# Altium project EDU_High-Speed-Design.PrjPcb (part 5 of 5)
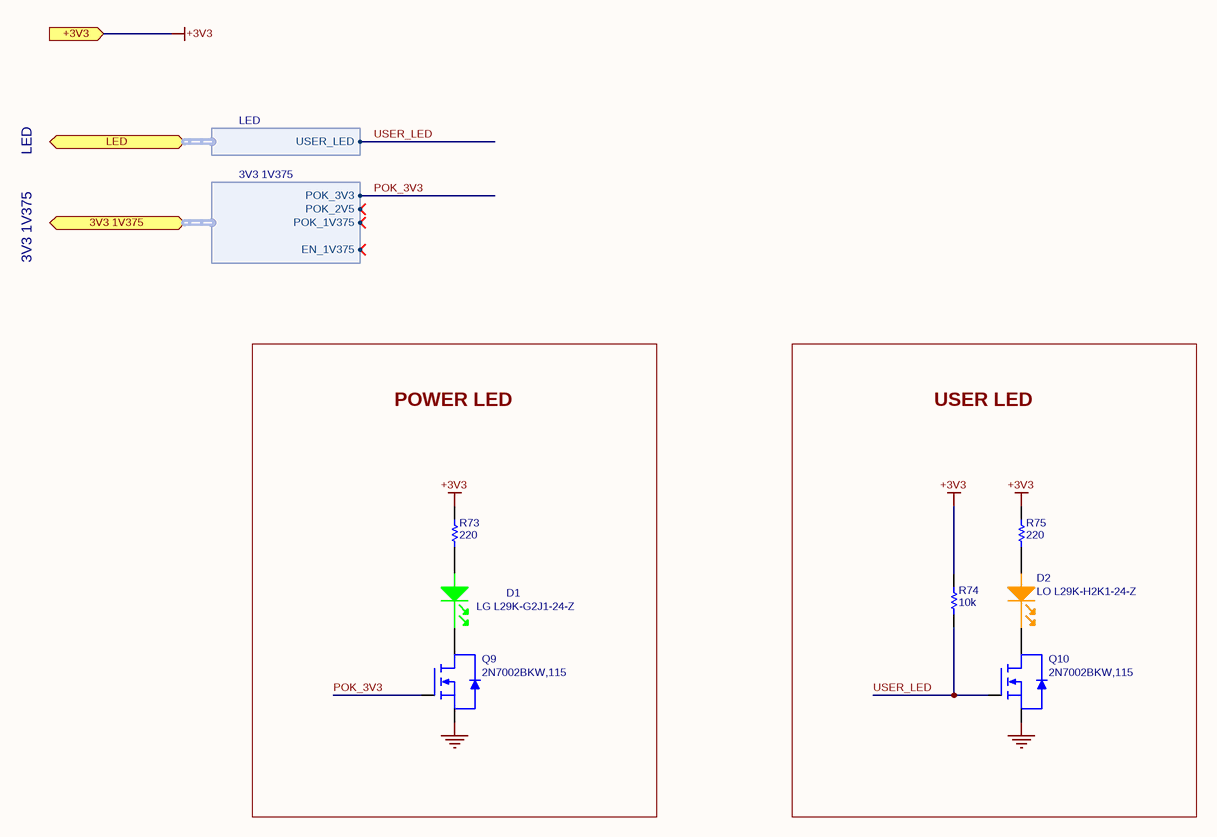
[diagram p32: EDU_High-Speed-Design_LED.SchDoc]

## Nets that join several sheets
+1V1: EDU_High-Speed-Design_CPU_HDMI (C220.1 R118.2), EDU_High-Speed-Design_CPU_PCIe (C228.1 FB8.2 R123.2), EDU_High-Speed-Design_CPU_SATA (R130.2)
+1V2_ETH: EDU_High-Speed-Design_CPU_Power (R80.1), EDU_High-Speed-Design_Ethernet (10 pins)
+1V5_DDR: EDU_High-Speed-Design_CPU_Control (R150.2), EDU_High-Speed-Design_CPU_DDR3 (30 pins), EDU_High-Speed-Design_DDR3 (113 pins), EDU_High-Speed-Design_Power_2V5_1V5 (C13.1 C15.1 L2.2 U1.30)
+1V375: EDU_High-Speed-Design_CPU_Power (30 pins), EDU_High-Speed-Design_Ethernet (FB1.2), EDU_High-Speed-Design_Power_3V3_1V375 (5 pins)
+2V5: EDU_High-Speed-Design_CPU_Power (C174.1 R76.1 R77.2 R78.2), EDU_High-Speed-Design_CPU_LVDS (R127.2), EDU_High-Speed-Design_CPU_HDMI (C217.1 R114.2), EDU_High-Speed-Design_CPU_PCIe (C226.1 R120.2), EDU_High-Speed-Design_CPU_SATA (C237.1 R129.2), EDU_High-Speed-Design_Ethernet (FB3.1), EDU_High-Speed-Design_Power_2V5_1V5 (5 pins)
+3V0: EDU_High-Speed-Design_CPU_Power (6 pins), EDU_High-Speed-Design_CPU_Control (9 pins), EDU_High-Speed-Design_Power_3V3_1V375 (R31.2), EDU_High-Speed-Design_Power_3V0 (6 pins), EDU_High-Speed-Design_Power_2V5_1V5 (R3.2 R6.2)
+3V3: EDU_High-Speed-Design_CPU_Power (21 pins), EDU_High-Speed-Design_CPU_Control (10 pins), EDU_High-Speed-Design_CPU_Audio (R133.2 R134.2), EDU_High-Speed-Design_CPU_USB (R108.2), EDU_High-Speed-Design_CPU_LVDS (R124.1 R125.1 R126.2), EDU_High-Speed-Design_CPU_HDMI (R110.1 R115.1 R116.1 R117.1), EDU_High-Speed-Design_CPU_SD-Card (R92.2 R93.2 R94.2), EDU_High-Speed-Design_CPU_MMC-Card (R97.2 R98.2 R99.2), EDU_High-Speed-Design_CPU_SPI_I2C (R104.1 R105.1), EDU_High-Speed-Design_Connectors (C36.1 J2.50), EDU_High-Speed-Design_Ethernet (C93.1 FB2.1 U9.1), EDU_High-Speed-Design_Flash (C121.1 R71.2 R72.2 U10.8), EDU_High-Speed-Design_Power_3V3_1V375 (7 pins), EDU_High-Speed-Design_LED (R73.1 R74.2 R75.1)
+5V_LDO1: EDU_High-Speed-Design_Power_3V3_1V375 (6 pins), EDU_High-Speed-Design_Power_2V5_1V5 (R1.2 R2.2)
+5V_USB: EDU_High-Speed-Design_CPU_USB (C212.2 C213.2 U11.D10 U11.E9), EDU_High-Speed-Design_Connectors (C41.1 J1.18)
+DDR_VREF: EDU_High-Speed-Design_CPU_DDR3 (6 pins), EDU_High-Speed-Design_DDR3 (16 pins)
+VIN: EDU_High-Speed-Design_Connectors (9 pins), EDU_High-Speed-Design_Power_3V3_1V375 (7 pins), EDU_High-Speed-Design_Power_3V0 (C16.1 U2.2 U2.3), EDU_High-Speed-Design_Power_2V5_1V5 (7 pins)
GND: EDU_High-Speed-Design_CPU_Power (182 pins), EDU_High-Speed-Design_CPU_Control (18 pins), EDU_High-Speed-Design_CPU_USB (C212.1 C213.1 C214.2 C215.2), EDU_High-Speed-Design_CPU_LVDS (C230.2 C231.2), EDU_High-Speed-Design_CPU_HDMI (7 pins), EDU_High-Speed-Design_CPU_PCIe (8 pins), EDU_High-Speed-Design_CPU_DDR3 (21 pins), EDU_High-Speed-Design_CPU_SATA (C234.2 C237.2 C238.2 R128.1), EDU_High-Speed-Design_Connectors (16 pins), EDU_High-Speed-Design_Ethernet (39 pins), EDU_High-Speed-Design_Flash (C121.2 U10.4 U10.9), EDU_High-Speed-Design_DDR3 (137 pins), EDU_High-Speed-Design_Power_3V3_1V375 (31 pins), EDU_High-Speed-Design_Power_3V0 (8 pins), EDU_High-Speed-Design_Power_2V5_1V5 (29 pins), EDU_High-Speed-Design_LED (Q9.2 Q10.2)
AUD3_CLK: EDU_High-Speed-Design_CPU_Audio (R132.1), EDU_High-Speed-Design_Connectors (J2.20)
AUD3_RXD: EDU_High-Speed-Design_CPU_Audio (U11.N3), EDU_High-Speed-Design_Connectors (J2.22)
AUD3_TXC: EDU_High-Speed-Design_CPU_Audio (R131.1), EDU_High-Speed-Design_Connectors (J2.16)
AUD3_TXD: EDU_High-Speed-Design_CPU_Audio (U11.P2), EDU_High-Speed-Design_Connectors (J2.18)
AUD3_TXFS: EDU_High-Speed-Design_CPU_Audio (U11.N4), EDU_High-Speed-Design_Connectors (J2.24)
BOOT_MODE: EDU_High-Speed-Design_CPU_Control (Q11.1 R135.1), EDU_High-Speed-Design_Connectors (J1.50)
CLK1_N: EDU_High-Speed-Design_CPU_PCIe (C222.2 R121.2), EDU_High-Speed-Design_Connectors (J2.46)
CLK1_P: EDU_High-Speed-Design_CPU_PCIe (C225.2 R122.2), EDU_High-Speed-Design_Connectors (J2.48)
CPU_GPIO1: EDU_High-Speed-Design_CPU_SPI_I2C (R103.2 R104.2 U11.D16), EDU_High-Speed-Design_Connectors (J1.37)
CSPI2_CLK: EDU_High-Speed-Design_CPU_SPI_I2C (R101.1), EDU_High-Speed-Design_Connectors (J1.17)
CSPI2_CS0: EDU_High-Speed-Design_CPU_SPI_I2C (U11.V25), EDU_High-Speed-Design_Connectors (J1.19)
CSPI2_MISO: EDU_High-Speed-Design_CPU_SPI_I2C (U11.U24), EDU_High-Speed-Design_Connectors (J1.21)
CSPI2_MOSI: EDU_High-Speed-Design_CPU_SPI_I2C (U11.T21), EDU_High-Speed-Design_Connectors (J1.23)
CSPI3_CLK: EDU_High-Speed-Design_CPU_SPI_I2C (R100.1), EDU_High-Speed-Design_Flash (U10.6)
CSPI3_CS2: EDU_High-Speed-Design_CPU_SPI_I2C (U11.R25), EDU_High-Speed-Design_Flash (U10.1)
CSPI3_MISO: EDU_High-Speed-Design_CPU_SPI_I2C (U11.P23), EDU_High-Speed-Design_Flash (U10.2)
CSPI3_MOSI: EDU_High-Speed-Design_CPU_SPI_I2C (U11.P22), EDU_High-Speed-Design_Flash (U10.5)
DRAM_A0: EDU_High-Speed-Design_CPU_DDR3 (U11.AC14), EDU_High-Speed-Design_DDR3 (U4.N3 U5.N3 U6.N3 U7.N3)
DRAM_A1: EDU_High-Speed-Design_CPU_DDR3 (U11.AB14), EDU_High-Speed-Design_DDR3 (U4.P7 U5.P7 U6.P7 U7.P7)
DRAM_A2: EDU_High-Speed-Design_CPU_DDR3 (U11.AA14), EDU_High-Speed-Design_DDR3 (U4.P3 U5.P3 U6.P3 U7.P3)
DRAM_A3: EDU_High-Speed-Design_CPU_DDR3 (U11.Y14), EDU_High-Speed-Design_DDR3 (U4.N2 U5.N2 U6.N2 U7.N2)
DRAM_A4: EDU_High-Speed-Design_CPU_DDR3 (U11.W14), EDU_High-Speed-Design_DDR3 (U4.P8 U5.P8 U6.P8 U7.P8)
DRAM_A5: EDU_High-Speed-Design_CPU_DDR3 (U11.AE13), EDU_High-Speed-Design_DDR3 (U4.P2 U5.P2 U6.P2 U7.P2)
DRAM_A6: EDU_High-Speed-Design_CPU_DDR3 (U11.AC13), EDU_High-Speed-Design_DDR3 (U4.R8 U5.R8 U6.R8 U7.R8)
DRAM_A7: EDU_High-Speed-Design_CPU_DDR3 (U11.Y13), EDU_High-Speed-Design_DDR3 (U4.R2 U5.R2 U6.R2 U7.R2)
DRAM_A8: EDU_High-Speed-Design_CPU_DDR3 (U11.AB13), EDU_High-Speed-Design_DDR3 (U4.T8 U5.T8 U6.T8 U7.T8)
DRAM_A9: EDU_High-Speed-Design_CPU_DDR3 (U11.AE12), EDU_High-Speed-Design_DDR3 (U4.R3 U5.R3 U6.R3 U7.R3)
DRAM_A10: EDU_High-Speed-Design_CPU_DDR3 (U11.AA15), EDU_High-Speed-Design_DDR3 (U4.L7 U5.L7 U6.L7 U7.L7)
DRAM_A11: EDU_High-Speed-Design_CPU_DDR3 (U11.AC12), EDU_High-Speed-Design_DDR3 (U4.R7 U5.R7 U6.R7 U7.R7)
DRAM_A12: EDU_High-Speed-Design_CPU_DDR3 (U11.AD12), EDU_High-Speed-Design_DDR3 (U4.N7 U5.N7 U6.N7 U7.N7)
DRAM_A13: EDU_High-Speed-Design_CPU_DDR3 (U11.AC17), EDU_High-Speed-Design_DDR3 (U4.T3 U5.T3 U6.T3 U7.T3)
DRAM_A14: EDU_High-Speed-Design_CPU_DDR3 (U11.AA12), EDU_High-Speed-Design_DDR3 (U4.T7 U5.T7 U6.T7 U7.T7)
DRAM_A15: EDU_High-Speed-Design_CPU_DDR3 (U11.Y12), EDU_High-Speed-Design_DDR3 (U4.M7 U5.M7 U6.M7 U7.M7)
DRAM_CAS_B: EDU_High-Speed-Design_CPU_DDR3 (U11.AE16), EDU_High-Speed-Design_DDR3 (U4.K3 U5.K3 U6.K3 U7.K3)
DRAM_CLK0_N: EDU_High-Speed-Design_CPU_DDR3 (R86.2 U11.AE15), EDU_High-Speed-Design_DDR3 (U5.K7 U7.K7)
DRAM_CLK0_P: EDU_High-Speed-Design_CPU_DDR3 (R86.1 U11.AD15), EDU_High-Speed-Design_DDR3 (U5.J7 U7.J7)
DRAM_CLK1_N: EDU_High-Speed-Design_CPU_DDR3 (R87.2 U11.AE14), EDU_High-Speed-Design_DDR3 (U4.K7 U6.K7)
DRAM_CLK1_P: EDU_High-Speed-Design_CPU_DDR3 (R87.1 U11.AD14), EDU_High-Speed-Design_DDR3 (U4.J7 U6.J7)
DRAM_CS0_B: EDU_High-Speed-Design_CPU_DDR3 (U11.Y16), EDU_High-Speed-Design_DDR3 (U4.L2 U5.L2 U6.L2 U7.L2)
DRAM_D0: EDU_High-Speed-Design_CPU_DDR3 (U11.AD2), EDU_High-Speed-Design_DDR3 (U4.D7)
DRAM_D1: EDU_High-Speed-Design_CPU_DDR3 (U11.AE2), EDU_High-Speed-Design_DDR3 (U4.B8)
DRAM_D2: EDU_High-Speed-Design_CPU_DDR3 (U11.AC4), EDU_High-Speed-Design_DDR3 (U4.C8)
DRAM_D3: EDU_High-Speed-Design_CPU_DDR3 (U11.AA5), EDU_High-Speed-Design_DDR3 (U4.A3)
DRAM_D4: EDU_High-Speed-Design_CPU_DDR3 (U11.AC1), EDU_High-Speed-Design_DDR3 (U4.C2)
DRAM_D5: EDU_High-Speed-Design_CPU_DDR3 (U11.AD1), EDU_High-Speed-Design_DDR3 (U4.C3)
DRAM_D6: EDU_High-Speed-Design_CPU_DDR3 (U11.AB4), EDU_High-Speed-Design_DDR3 (U4.A2)
DRAM_D7: EDU_High-Speed-Design_CPU_DDR3 (U11.AE4), EDU_High-Speed-Design_DDR3 (U4.A7)
DRAM_D8: EDU_High-Speed-Design_CPU_DDR3 (U11.AD5), EDU_High-Speed-Design_DDR3 (U4.E3)
DRAM_D9: EDU_High-Speed-Design_CPU_DDR3 (U11.AE5), EDU_High-Speed-Design_DDR3 (U4.F7)
DRAM_D10: EDU_High-Speed-Design_CPU_DDR3 (U11.AA6), EDU_High-Speed-Design_DDR3 (U4.G2)
DRAM_D11: EDU_High-Speed-Design_CPU_DDR3 (U11.AE7), EDU_High-Speed-Design_DDR3 (U4.H7)
DRAM_D12: EDU_High-Speed-Design_CPU_DDR3 (U11.AB5), EDU_High-Speed-Design_DDR3 (U4.H3)
DRAM_D13: EDU_High-Speed-Design_CPU_DDR3 (U11.AC5), EDU_High-Speed-Design_DDR3 (U4.F2)
DRAM_D14: EDU_High-Speed-Design_CPU_DDR3 (U11.AB6), EDU_High-Speed-Design_DDR3 (U4.F8)
DRAM_D15: EDU_High-Speed-Design_CPU_DDR3 (U11.AC7), EDU_High-Speed-Design_DDR3 (U4.H8)
DRAM_D16: EDU_High-Speed-Design_CPU_DDR3 (U11.AB7), EDU_High-Speed-Design_DDR3 (U6.E3)
DRAM_D17: EDU_High-Speed-Design_CPU_DDR3 (U11.AA8), EDU_High-Speed-Design_DDR3 (U6.F8)
DRAM_D18: EDU_High-Speed-Design_CPU_DDR3 (U11.AB9), EDU_High-Speed-Design_DDR3 (U6.H7)
DRAM_D19: EDU_High-Speed-Design_CPU_DDR3 (U11.Y9), EDU_High-Speed-Design_DDR3 (U6.H3)
DRAM_D20: EDU_High-Speed-Design_CPU_DDR3 (U11.Y7), EDU_High-Speed-Design_DDR3 (U6.H8)
DRAM_D21: EDU_High-Speed-Design_CPU_DDR3 (U11.Y8), EDU_High-Speed-Design_DDR3 (U6.G2)
DRAM_D22: EDU_High-Speed-Design_CPU_DDR3 (U11.AC8), EDU_High-Speed-Design_DDR3 (U6.F7)
DRAM_D23: EDU_High-Speed-Design_CPU_DDR3 (U11.AA9), EDU_High-Speed-Design_DDR3 (U6.F2)
DRAM_D24: EDU_High-Speed-Design_CPU_DDR3 (U11.AE9), EDU_High-Speed-Design_DDR3 (U6.D7)
DRAM_D25: EDU_High-Speed-Design_CPU_DDR3 (U11.Y10), EDU_High-Speed-Design_DDR3 (U6.A7)
DRAM_D26: EDU_High-Speed-Design_CPU_DDR3 (U11.AE11), EDU_High-Speed-Design_DDR3 (U6.C3)
DRAM_D27: EDU_High-Speed-Design_CPU_DDR3 (U11.AB11), EDU_High-Speed-Design_DDR3 (U6.C2)
DRAM_D28: EDU_High-Speed-Design_CPU_DDR3 (U11.AC9), EDU_High-Speed-Design_DDR3 (U6.C8)
DRAM_D29: EDU_High-Speed-Design_CPU_DDR3 (U11.AD9), EDU_High-Speed-Design_DDR3 (U6.B8)
DRAM_D30: EDU_High-Speed-Design_CPU_DDR3 (U11.AD11), EDU_High-Speed-Design_DDR3 (U6.A2)
DRAM_D31: EDU_High-Speed-Design_CPU_DDR3 (U11.AC11), EDU_High-Speed-Design_DDR3 (U6.A3)
DRAM_D32: EDU_High-Speed-Design_CPU_DDR3 (U11.AA17), EDU_High-Speed-Design_DDR3 (U7.E3)
DRAM_D33: EDU_High-Speed-Design_CPU_DDR3 (U11.AA18), EDU_High-Speed-Design_DDR3 (U7.G2)
DRAM_D34: EDU_High-Speed-Design_CPU_DDR3 (U11.AC18), EDU_High-Speed-Design_DDR3 (U7.F8)
DRAM_D35: EDU_High-Speed-Design_CPU_DDR3 (U11.AE19), EDU_High-Speed-Design_DDR3 (U7.H7)
DRAM_D36: EDU_High-Speed-Design_CPU_DDR3 (U11.Y17), EDU_High-Speed-Design_DDR3 (U7.H3)
DRAM_D37: EDU_High-Speed-Design_CPU_DDR3 (U11.Y18), EDU_High-Speed-Design_DDR3 (U7.F2)
DRAM_D38: EDU_High-Speed-Design_CPU_DDR3 (U11.AB19), EDU_High-Speed-Design_DDR3 (U7.H8)
DRAM_D39: EDU_High-Speed-Design_CPU_DDR3 (U11.AC19), EDU_High-Speed-Design_DDR3 (U7.F7)
DRAM_D40: EDU_High-Speed-Design_CPU_DDR3 (U11.Y19), EDU_High-Speed-Design_DDR3 (U7.D7)
DRAM_D41: EDU_High-Speed-Design_CPU_DDR3 (U11.AB20), EDU_High-Speed-Design_DDR3 (U7.B8)
DRAM_D42: EDU_High-Speed-Design_CPU_DDR3 (U11.AB21), EDU_High-Speed-Design_DDR3 (U7.C2)
DRAM_D43: EDU_High-Speed-Design_CPU_DDR3 (U11.AD21), EDU_High-Speed-Design_DDR3 (U7.A7)
DRAM_D44: EDU_High-Speed-Design_CPU_DDR3 (U11.Y20), EDU_High-Speed-Design_DDR3 (U7.A2)
DRAM_D45: EDU_High-Speed-Design_CPU_DDR3 (U11.AA20), EDU_High-Speed-Design_DDR3 (U7.C8)
DRAM_D46: EDU_High-Speed-Design_CPU_DDR3 (U11.AE21), EDU_High-Speed-Design_DDR3 (U7.A3)
DRAM_D47: EDU_High-Speed-Design_CPU_DDR3 (U11.AC21), EDU_High-Speed-Design_DDR3 (U7.C3)
DRAM_D48: EDU_High-Speed-Design_CPU_DDR3 (U11.AC22), EDU_High-Speed-Design_DDR3 (U5.D7)
DRAM_D49: EDU_High-Speed-Design_CPU_DDR3 (U11.AE22), EDU_High-Speed-Design_DDR3 (U5.C2)
DRAM_D50: EDU_High-Speed-Design_CPU_DDR3 (U11.AE24), EDU_High-Speed-Design_DDR3 (U5.C3)
DRAM_D51: EDU_High-Speed-Design_CPU_DDR3 (U11.AC24), EDU_High-Speed-Design_DDR3 (U5.B8)
DRAM_D52: EDU_High-Speed-Design_CPU_DDR3 (U11.AB22), EDU_High-Speed-Design_DDR3 (U5.A7)
DRAM_D53: EDU_High-Speed-Design_CPU_DDR3 (U11.AC23), EDU_High-Speed-Design_DDR3 (U5.C8)
DRAM_D54: EDU_High-Speed-Design_CPU_DDR3 (U11.AD25), EDU_High-Speed-Design_DDR3 (U5.A3)
DRAM_D55: EDU_High-Speed-Design_CPU_DDR3 (U11.AC25), EDU_High-Speed-Design_DDR3 (U5.A2)
DRAM_D56: EDU_High-Speed-Design_CPU_DDR3 (U11.AB25), EDU_High-Speed-Design_DDR3 (U5.E3)
DRAM_D57: EDU_High-Speed-Design_CPU_DDR3 (U11.AA21), EDU_High-Speed-Design_DDR3 (U5.G2)
DRAM_D58: EDU_High-Speed-Design_CPU_DDR3 (U11.Y25), EDU_High-Speed-Design_DDR3 (U5.H7)
DRAM_D59: EDU_High-Speed-Design_CPU_DDR3 (U11.Y22), EDU_High-Speed-Design_DDR3 (U5.F7)
DRAM_D60: EDU_High-Speed-Design_CPU_DDR3 (U11.AB23), EDU_High-Speed-Design_DDR3 (U5.H3)
DRAM_D61: EDU_High-Speed-Design_CPU_DDR3 (U11.AA23), EDU_High-Speed-Design_DDR3 (U5.F2)
DRAM_D62: EDU_High-Speed-Design_CPU_DDR3 (U11.Y23), EDU_High-Speed-Design_DDR3 (U5.F8)
DRAM_D63: EDU_High-Speed-Design_CPU_DDR3 (U11.W25), EDU_High-Speed-Design_DDR3 (U5.H8)
DRAM_DQM0: EDU_High-Speed-Design_CPU_DDR3 (U11.AC3), EDU_High-Speed-Design_DDR3 (U4.D3)
DRAM_DQM1: EDU_High-Speed-Design_CPU_DDR3 (U11.AC6), EDU_High-Speed-Design_DDR3 (U4.E7)
DRAM_DQM2: EDU_High-Speed-Design_CPU_DDR3 (U11.AB8), EDU_High-Speed-Design_DDR3 (U6.E7)
DRAM_DQM3: EDU_High-Speed-Design_CPU_DDR3 (U11.AE10), EDU_High-Speed-Design_DDR3 (U6.D3)
DRAM_DQM4: EDU_High-Speed-Design_CPU_DDR3 (U11.AB18), EDU_High-Speed-Design_DDR3 (U7.E7)
DRAM_DQM5: EDU_High-Speed-Design_CPU_DDR3 (U11.AC20), EDU_High-Speed-Design_DDR3 (U7.D3)
DRAM_DQM6: EDU_High-Speed-Design_CPU_DDR3 (U11.AD24), EDU_High-Speed-Design_DDR3 (U5.D3)
DRAM_DQM7: EDU_High-Speed-Design_CPU_DDR3 (U11.Y21), EDU_High-Speed-Design_DDR3 (U5.E7)
DRAM_DQS0_N: EDU_High-Speed-Design_CPU_DDR3 (U11.AD3), EDU_High-Speed-Design_DDR3 (U4.B7)
DRAM_DQS0_P: EDU_High-Speed-Design_CPU_DDR3 (U11.AE3), EDU_High-Speed-Design_DDR3 (U4.C7)
DRAM_DQS1_N: EDU_High-Speed-Design_CPU_DDR3 (U11.AE6), EDU_High-Speed-Design_DDR3 (U4.G3)
DRAM_DQS1_P: EDU_High-Speed-Design_CPU_DDR3 (U11.AD6), EDU_High-Speed-Design_DDR3 (U4.F3)
DRAM_DQS2_N: EDU_High-Speed-Design_CPU_DDR3 (U11.AE8), EDU_High-Speed-Design_DDR3 (U6.G3)
DRAM_DQS2_P: EDU_High-Speed-Design_CPU_DDR3 (U11.AD8), EDU_High-Speed-Design_DDR3 (U6.F3)
DRAM_DQS3_N: EDU_High-Speed-Design_CPU_DDR3 (U11.AB10), EDU_High-Speed-Design_DDR3 (U6.B7)
DRAM_DQS3_P: EDU_High-Speed-Design_CPU_DDR3 (U11.AC10), EDU_High-Speed-Design_DDR3 (U6.C7)
DRAM_DQS4_N: EDU_High-Speed-Design_CPU_DDR3 (U11.AE18), EDU_High-Speed-Design_DDR3 (U7.G3)
DRAM_DQS4_P: EDU_High-Speed-Design_CPU_DDR3 (U11.AD18), EDU_High-Speed-Design_DDR3 (U7.F3)
DRAM_DQS5_N: EDU_High-Speed-Design_CPU_DDR3 (U11.AE20), EDU_High-Speed-Design_DDR3 (U7.B7)
DRAM_DQS5_P: EDU_High-Speed-Design_CPU_DDR3 (U11.AD20), EDU_High-Speed-Design_DDR3 (U7.C7)
DRAM_DQS6_N: EDU_High-Speed-Design_CPU_DDR3 (U11.AE23), EDU_High-Speed-Design_DDR3 (U5.B7)
DRAM_DQS6_P: EDU_High-Speed-Design_CPU_DDR3 (U11.AD23), EDU_High-Speed-Design_DDR3 (U5.C7)
DRAM_DQS7_N: EDU_High-Speed-Design_CPU_DDR3 (U11.AA24), EDU_High-Speed-Design_DDR3 (U5.G3)
DRAM_DQS7_P: EDU_High-Speed-Design_CPU_DDR3 (U11.AA25), EDU_High-Speed-Design_DDR3 (U5.F3)
DRAM_RAS_B: EDU_High-Speed-Design_CPU_DDR3 (U11.AB15), EDU_High-Speed-Design_DDR3 (U4.J3 U5.J3 U6.J3 U7.J3)
DRAM_RESET_B: EDU_High-Speed-Design_CPU_DDR3 (R85.1 U11.Y6), EDU_High-Speed-Design_DDR3 (U4.T2 U5.T2 U6.T2 U7.T2)
DRAM_SDBA0: EDU_High-Speed-Design_CPU_DDR3 (U11.AC15), EDU_High-Speed-Design_DDR3 (U4.M2 U5.M2 U6.M2 U7.M2)
DRAM_SDBA1: EDU_High-Speed-Design_CPU_DDR3 (U11.Y15), EDU_High-Speed-Design_DDR3 (U4.N8 U5.N8 U6.N8 U7.N8)
DRAM_SDBA2: EDU_High-Speed-Design_CPU_DDR3 (U11.AB12), EDU_High-Speed-Design_DDR3 (U4.M3 U5.M3 U6.M3 U7.M3)
DRAM_SDCKE0: EDU_High-Speed-Design_CPU_DDR3 (R84.1 U11.Y11), EDU_High-Speed-Design_DDR3 (U4.K9 U5.K9 U6.K9 U7.K9)
DRAM_SDODT0: EDU_High-Speed-Design_CPU_DDR3 (U11.AC16), EDU_High-Speed-Design_DDR3 (U4.K1 U5.K1 U6.K1 U7.K1)
DRAM_WE_B: EDU_High-Speed-Design_CPU_DDR3 (U11.AB16), EDU_High-Speed-Design_DDR3 (U4.L3 U5.L3 U6.L3 U7.L3)
EN_1V375: EDU_High-Speed-Design_Power_3V3_1V375 (Q6.3 R27.1 R30.2 U3.27), EDU_High-Speed-Design_Power_3V0 (R23.2)
ETH_LED_LINK: EDU_High-Speed-Design_Connectors (J1.56), EDU_High-Speed-Design_Ethernet (R66.1)
ETH_LED_RX: EDU_High-Speed-Design_Connectors (J1.55), EDU_High-Speed-Design_Ethernet (R68.1)
ETH_REF_CLK: EDU_High-Speed-Design_CPU_Ethernet (U11.V22), EDU_High-Speed-Design_Ethernet (R70.1)
HDMI_CEC_IN: EDU_High-Speed-Design_CPU_HDMI (R111.1 R112.1 R115.2), EDU_High-Speed-Design_Connectors (J1.44)
HDMI_CLK_N: EDU_High-Speed-Design_CPU_HDMI (U11.J5), EDU_High-Speed-Design_Connectors (J1.45)
HDMI_CLK_P: EDU_High-Speed-Design_CPU_HDMI (U11.J6), EDU_High-Speed-Design_Connectors (J1.47)
HDMI_D0_N: EDU_High-Speed-Design_CPU_HDMI (U11.K5), EDU_High-Speed-Design_Connectors (J1.39)
HDMI_D0_P: EDU_High-Speed-Design_CPU_HDMI (U11.K6), EDU_High-Speed-Design_Connectors (J1.41)
HDMI_D1_N: EDU_High-Speed-Design_CPU_HDMI (U11.J3), EDU_High-Speed-Design_Connectors (J1.46)
HDMI_D1_P: EDU_High-Speed-Design_CPU_HDMI (U11.J4), EDU_High-Speed-Design_Connectors (J1.48)
HDMI_D2_N: EDU_High-Speed-Design_CPU_HDMI (U11.K3), EDU_High-Speed-Design_Connectors (J1.40)
HDMI_D2_P: EDU_High-Speed-Design_CPU_HDMI (U11.K4), EDU_High-Speed-Design_Connectors (J1.42)
HDMI_HPD: EDU_High-Speed-Design_CPU_HDMI (C219.1 R110.2 U11.K1), EDU_High-Speed-Design_Connectors (J1.43)
I2C1_SCL: EDU_High-Speed-Design_CPU_Audio (R134.1 U11.N5), EDU_High-Speed-Design_Connectors (J2.14)
I2C1_SDA: EDU_High-Speed-Design_CPU_Audio (R133.1 U11.N6), EDU_High-Speed-Design_Connectors (J2.12)
I2C2_SCL: EDU_High-Speed-Design_CPU_HDMI (R116.2 U11.U5), EDU_High-Speed-Design_Connectors (J1.36)
I2C2_SDA: EDU_High-Speed-Design_CPU_HDMI (R117.2 U11.T7), EDU_High-Speed-Design_Connectors (J1.38)
I2C3_SCL: EDU_High-Speed-Design_CPU_LVDS (R124.2 U11.F21), EDU_High-Speed-Design_CPU_SPI_I2C (R102.1), EDU_High-Speed-Design_Connectors (J2.19)
I2C3_SDA: EDU_High-Speed-Design_CPU_LVDS (R125.2 U11.D24), EDU_High-Speed-Design_CPU_SPI_I2C (R103.1), EDU_High-Speed-Design_Connectors (J2.17)
JTAG_nTRST: EDU_High-Speed-Design_CPU_Control (R164.1 U11.C2), EDU_High-Speed-Design_Connectors (J2.41)
JTAG_TCK: EDU_High-Speed-Design_CPU_Control (R155.1), EDU_High-Speed-Design_Connectors (J2.43)
JTAG_TDI: EDU_High-Speed-Design_CPU_Control (R154.1), EDU_High-Speed-Design_Connectors (J2.47)
JTAG_TDO: EDU_High-Speed-Design_CPU_Control (R156.1), EDU_High-Speed-Design_Connectors (J2.45)
JTAG_TMS: EDU_High-Speed-Design_CPU_Control (R163.1 U11.C3), EDU_High-Speed-Design_Connectors (J2.49)
LVDS0_CABC: EDU_High-Speed-Design_CPU_LVDS (R126.1 U11.A17), EDU_High-Speed-Design_Connectors (J2.6)
LVDS0_CLK_N: EDU_High-Speed-Design_CPU_LVDS (U11.V4), EDU_High-Speed-Design_Connectors (J2.13)
LVDS0_CLK_P: EDU_High-Speed-Design_CPU_LVDS (U11.V3), EDU_High-Speed-Design_Connectors (J2.15)
LVDS0_PWM: EDU_High-Speed-Design_CPU_LVDS (U11.F18), EDU_High-Speed-Design_Connectors (J2.5)
LVDS0_TX0_N: EDU_High-Speed-Design_CPU_LVDS (U11.U2), EDU_High-Speed-Design_Connectors (J2.2)
LVDS0_TX0_P: EDU_High-Speed-Design_CPU_LVDS (U11.U1), EDU_High-Speed-Design_Connectors (J2.4)
LVDS0_TX1_N: EDU_High-Speed-Design_CPU_LVDS (U11.U4), EDU_High-Speed-Design_Connectors (J2.8)
LVDS0_TX1_P: EDU_High-Speed-Design_CPU_LVDS (U11.U3), EDU_High-Speed-Design_Connectors (J2.10)
LVDS0_TX2_N: EDU_High-Speed-Design_CPU_LVDS (U11.V2), EDU_High-Speed-Design_Connectors (J2.1)
LVDS0_TX2_P: EDU_High-Speed-Design_CPU_LVDS (U11.V1), EDU_High-Speed-Design_Connectors (J2.3)
LVDS0_TX3_N: EDU_High-Speed-Design_CPU_LVDS (U11.W2), EDU_High-Speed-Design_Connectors (J2.7)
LVDS0_TX3_P: EDU_High-Speed-Design_CPU_LVDS (U11.W1), EDU_High-Speed-Design_Connectors (J2.9)
ON_OFF: EDU_High-Speed-Design_CPU_Control (R137.2 U11.D12), EDU_High-Speed-Design_Connectors (J1.6)
PCIE_RX_N: EDU_High-Speed-Design_CPU_PCIe (U11.B1), EDU_High-Speed-Design_Connectors (J2.52)
PCIE_RX_P: EDU_High-Speed-Design_CPU_PCIe (U11.B2), EDU_High-Speed-Design_Connectors (J2.54)
PCIE_TX_N: EDU_High-Speed-Design_CPU_PCIe (C221.2), EDU_High-Speed-Design_Connectors (J2.51)
PCIE_TX_P: EDU_High-Speed-Design_CPU_PCIe (C224.2), EDU_High-Speed-Design_Connectors (J2.53)
PCIE_WAKE: EDU_High-Speed-Design_CPU_PCIe (U11.P3), EDU_High-Speed-Design_Connectors (J2.39)
PMIC_ON_REQ: EDU_High-Speed-Design_CPU_Control (R136.1 U11.D11), EDU_High-Speed-Design_Power_3V3_1V375 (Q5.1), EDU_High-Speed-Design_Power_2V5_1V5 (Q1.1)
POK_2V5: EDU_High-Speed-Design_Power_3V3_1V375 (U3.14), EDU_High-Speed-Design_Power_2V5_1V5 (R4.2)
POK_3V3: EDU_High-Speed-Design_CPU_Control (U12.4 U13.3), EDU_High-Speed-Design_Ethernet (U9.9), EDU_High-Speed-Design_Power_3V3_1V375 (R29.2), EDU_High-Speed-Design_LED (Q9.1)
RGMII_INT: EDU_High-Speed-Design_CPU_Ethernet (R107.1 U11.W22), EDU_High-Speed-Design_Ethernet (R58.1 U8.38)
RGMII_MDC: EDU_High-Speed-Design_CPU_Ethernet (U11.V20), EDU_High-Speed-Design_Ethernet (R56.1 R62.2)
RGMII_MDIO: EDU_High-Speed-Design_CPU_Ethernet (U11.V23), EDU_High-Speed-Design_Ethernet (R57.1 R63.2)
RGMII_RSTn: EDU_High-Speed-Design_CPU_Control (D3.2 R158.2), EDU_High-Speed-Design_Ethernet (R59.2 U8.42)
RGMII_RXCLK: EDU_High-Speed-Design_CPU_Ethernet (U11.B25), EDU_High-Speed-Design_Ethernet (R61.2)
RGMII_RXD0: EDU_High-Speed-Design_CPU_Ethernet (U11.C24), EDU_High-Speed-Design_Ethernet (R55.2 U8.32)
RGMII_RXD1: EDU_High-Speed-Design_CPU_Ethernet (U11.B23), EDU_High-Speed-Design_Ethernet (R54.2 U8.31)
RGMII_RXD2: EDU_High-Speed-Design_CPU_Ethernet (U11.B24), EDU_High-Speed-Design_Ethernet (R53.2 U8.28)
RGMII_RXD3: EDU_High-Speed-Design_CPU_Ethernet (U11.D23), EDU_High-Speed-Design_Ethernet (R52.2 U8.27)
RGMII_RXDV: EDU_High-Speed-Design_CPU_Ethernet (U11.D22), EDU_High-Speed-Design_Ethernet (R51.2 U8.33)
RGMII_TXCLK: EDU_High-Speed-Design_CPU_Ethernet (R106.1), EDU_High-Speed-Design_Ethernet (U8.24)
RGMII_TXD0: EDU_High-Speed-Design_CPU_Ethernet (U11.C22), EDU_High-Speed-Design_Ethernet (U8.19)
RGMII_TXD1: EDU_High-Speed-Design_CPU_Ethernet (U11.F20), EDU_High-Speed-Design_Ethernet (U8.20)
RGMII_TXD2: EDU_High-Speed-Design_CPU_Ethernet (U11.E21), EDU_High-Speed-Design_Ethernet (U8.21)
RGMII_TXD3: EDU_High-Speed-Design_CPU_Ethernet (U11.A24), EDU_High-Speed-Design_Ethernet (U8.22)
RGMII_TXEN: EDU_High-Speed-Design_CPU_Ethernet (U11.C23), EDU_High-Speed-Design_Ethernet (U8.25)
RSTINn: EDU_High-Speed-Design_CPU_Control (R147.1 U12.1), EDU_High-Speed-Design_Connectors (J1.8)
RSTOUTn: EDU_High-Speed-Design_CPU_Control (R159.2 R165.1), EDU_High-Speed-Design_Connectors (J1.7)
SATA_RX_N: EDU_High-Speed-Design_CPU_SATA (C232.2), EDU_High-Speed-Design_Connectors (J2.58)
SATA_RX_P: EDU_High-Speed-Design_CPU_SATA (C235.2), EDU_High-Speed-Design_Connectors (J2.60)
SATA_TX_N: EDU_High-Speed-Design_CPU_SATA (C233.2), EDU_High-Speed-Design_Connectors (J2.57)
SATA_TX_P: EDU_High-Speed-Design_CPU_SATA (C236.2), EDU_High-Speed-Design_Connectors (J2.59)
SD2_ACT: EDU_High-Speed-Design_CPU_MMC-Card (U11.T3), EDU_High-Speed-Design_Connectors (J2.11)
SD2_CD: EDU_High-Speed-Design_CPU_MMC-Card (R98.1 U11.F16), EDU_High-Speed-Design_Connectors (J2.38)
SD2_CLK: EDU_High-Speed-Design_CPU_MMC-Card (R96.1), EDU_High-Speed-Design_Connectors (J2.36)
SD2_CMD: EDU_High-Speed-Design_CPU_MMC-Card (R95.1 R97.1), EDU_High-Speed-Design_Connectors (J2.21)
SD2_DATA0: EDU_High-Speed-Design_CPU_MMC-Card (U11.A22), EDU_High-Speed-Design_Connectors (J2.26)
SD2_DATA1: EDU_High-Speed-Design_CPU_MMC-Card (U11.E20), EDU_High-Speed-Design_Connectors (J2.23)
SD2_DATA2: EDU_High-Speed-Design_CPU_MMC-Card (U11.A23), EDU_High-Speed-Design_Connectors (J2.28)
SD2_DATA3: EDU_High-Speed-Design_CPU_MMC-Card (U11.B22), EDU_High-Speed-Design_Connectors (J2.25)
SD2_DATA4: EDU_High-Speed-Design_CPU_MMC-Card (U11.A19), EDU_High-Speed-Design_Connectors (J2.30)
SD2_DATA5: EDU_High-Speed-Design_CPU_MMC-Card (U11.B18), EDU_High-Speed-Design_Connectors (J2.27)
SD2_DATA6: EDU_High-Speed-Design_CPU_MMC-Card (U11.E17), EDU_High-Speed-Design_Connectors (J2.32)
SD2_DATA7: EDU_High-Speed-Design_CPU_MMC-Card (U11.C18), EDU_High-Speed-Design_Connectors (J2.29)
SD2_WP: EDU_High-Speed-Design_CPU_MMC-Card (R99.1 U11.D17), EDU_High-Speed-Design_Connectors (J2.34)
SD3_CD: EDU_High-Speed-Design_CPU_SD-Card (R93.1 U11.A18), EDU_High-Speed-Design_Connectors (J1.34)
SD3_CLK: EDU_High-Speed-Design_CPU_SD-Card (R91.1), EDU_High-Speed-Design_Connectors (J1.27)
SD3_CMD: EDU_High-Speed-Design_CPU_SD-Card (R90.1 R92.1), EDU_High-Speed-Design_Connectors (J1.33 J1.35)
SD3_DATA0: EDU_High-Speed-Design_CPU_SD-Card (U11.E14), EDU_High-Speed-Design_Connectors (J1.29)
SD3_DATA1: EDU_High-Speed-Design_CPU_SD-Card (U11.F14), EDU_High-Speed-Design_Connectors (J1.30)
SD3_DATA2: EDU_High-Speed-Design_CPU_SD-Card (U11.A15), EDU_High-Speed-Design_Connectors (J1.31)
SD3_DATA3: EDU_High-Speed-Design_CPU_SD-Card (U11.B15), EDU_High-Speed-Design_Connectors (J1.32)
SD3_WP: EDU_High-Speed-Design_CPU_SD-Card (R94.1 U11.C17), EDU_High-Speed-Design_Connectors (J1.25)
TRD0_N: EDU_High-Speed-Design_Connectors (J1.57), EDU_High-Speed-Design_Ethernet (U8.3)
TRD0_P: EDU_High-Speed-Design_Connectors (J1.59), EDU_High-Speed-Design_Ethernet (U8.2)
TRD1_N: EDU_High-Speed-Design_Connectors (J1.51), EDU_High-Speed-Design_Ethernet (U8.6)
TRD1_P: EDU_High-Speed-Design_Connectors (J1.53), EDU_High-Speed-Design_Ethernet (U8.5)
TRD2_N: EDU_High-Speed-Design_Connectors (J1.58), EDU_High-Speed-Design_Ethernet (U8.8)
TRD2_P: EDU_High-Speed-Design_Connectors (J1.60), EDU_High-Speed-Design_Ethernet (U8.7)
TRD3_N: EDU_High-Speed-Design_Connectors (J1.52), EDU_High-Speed-Design_Ethernet (U8.11)
TRD3_P: EDU_High-Speed-Design_Connectors (J1.54), EDU_High-Speed-Design_Ethernet (U8.10)
UART1_CTS: EDU_High-Speed-Design_CPU_Uart (U11.G21), EDU_High-Speed-Design_Connectors (J1.11)
UART1_DCD: EDU_High-Speed-Design_CPU_Uart (U11.D25), EDU_High-Speed-Design_Connectors (J1.16)
UART1_DSR: EDU_High-Speed-Design_CPU_Uart (U11.G22), EDU_High-Speed-Design_Connectors (J1.9)
UART1_DTR: EDU_High-Speed-Design_CPU_Uart (U11.F22), EDU_High-Speed-Design_Connectors (J1.15)
UART1_RI: EDU_High-Speed-Design_CPU_Uart (U11.F23), EDU_High-Speed-Design_Connectors (J1.10)
UART1_RTS: EDU_High-Speed-Design_CPU_Uart (U11.G20), EDU_High-Speed-Design_Connectors (J1.13)
UART1_RXD: EDU_High-Speed-Design_CPU_Uart (U11.M3), EDU_High-Speed-Design_Connectors (J1.14)
UART1_TXD: EDU_High-Speed-Design_CPU_Uart (U11.M1), EDU_High-Speed-Design_Connectors (J1.12)
UART2_CTS: EDU_High-Speed-Design_CPU_Uart (U11.B20), EDU_High-Speed-Design_Connectors (J2.31)
UART2_RTS: EDU_High-Speed-Design_CPU_Uart (U11.C19), EDU_High-Speed-Design_Connectors (J2.33)
UART2_RXD: EDU_High-Speed-Design_CPU_Uart (U11.E18), EDU_High-Speed-Design_Connectors (J2.35)
UART2_TXD: EDU_High-Speed-Design_CPU_Uart (U11.D19), EDU_High-Speed-Design_Connectors (J2.37)
USB0_ID: EDU_High-Speed-Design_CPU_USB (U11.T4), EDU_High-Speed-Design_Connectors (J1.20)
USB0_N: EDU_High-Speed-Design_CPU_USB (U11.B6), EDU_High-Speed-Design_Connectors (J1.22)
USB0_P: EDU_High-Speed-Design_CPU_USB (U11.A6), EDU_High-Speed-Design_Connectors (J1.24)
USB0_PWR_EN: EDU_High-Speed-Design_CPU_USB (U11.E23), EDU_High-Speed-Design_Connectors (J1.26)
USB1_N: EDU_High-Speed-Design_CPU_USB (U11.F10), EDU_High-Speed-Design_Connectors (J2.40)
USB1_P: EDU_High-Speed-Design_CPU_USB (U11.E10), EDU_High-Speed-Design_Connectors (J2.42)
USB1_PWR_EN: EDU_High-Speed-Design_CPU_USB (U11.H21), EDU_High-Speed-Design_Connectors (J2.44)
USB_OC: EDU_High-Speed-Design_CPU_USB (R108.1 U11.H20 U11.J20), EDU_High-Speed-Design_Connectors (J1.28)
USER_LED: EDU_High-Speed-Design_CPU_Control (U11.T1), EDU_High-Speed-Design_LED (Q10.1 R74.1)

## Assembly variants
PRODUCTION: not fitted FB1 Q1 Q2 Q5 Q6 R1 R7 R12 R15 R16 R26 R32 R37 R40 R41 R56 R80 R81 R82 R102 R103 R112 R139 R141 R148 R158 R159 R161 R162